# Altium schematic sheet Detector.SchDoc
size A4; SheetNumber: 1; SheetTotal: 1
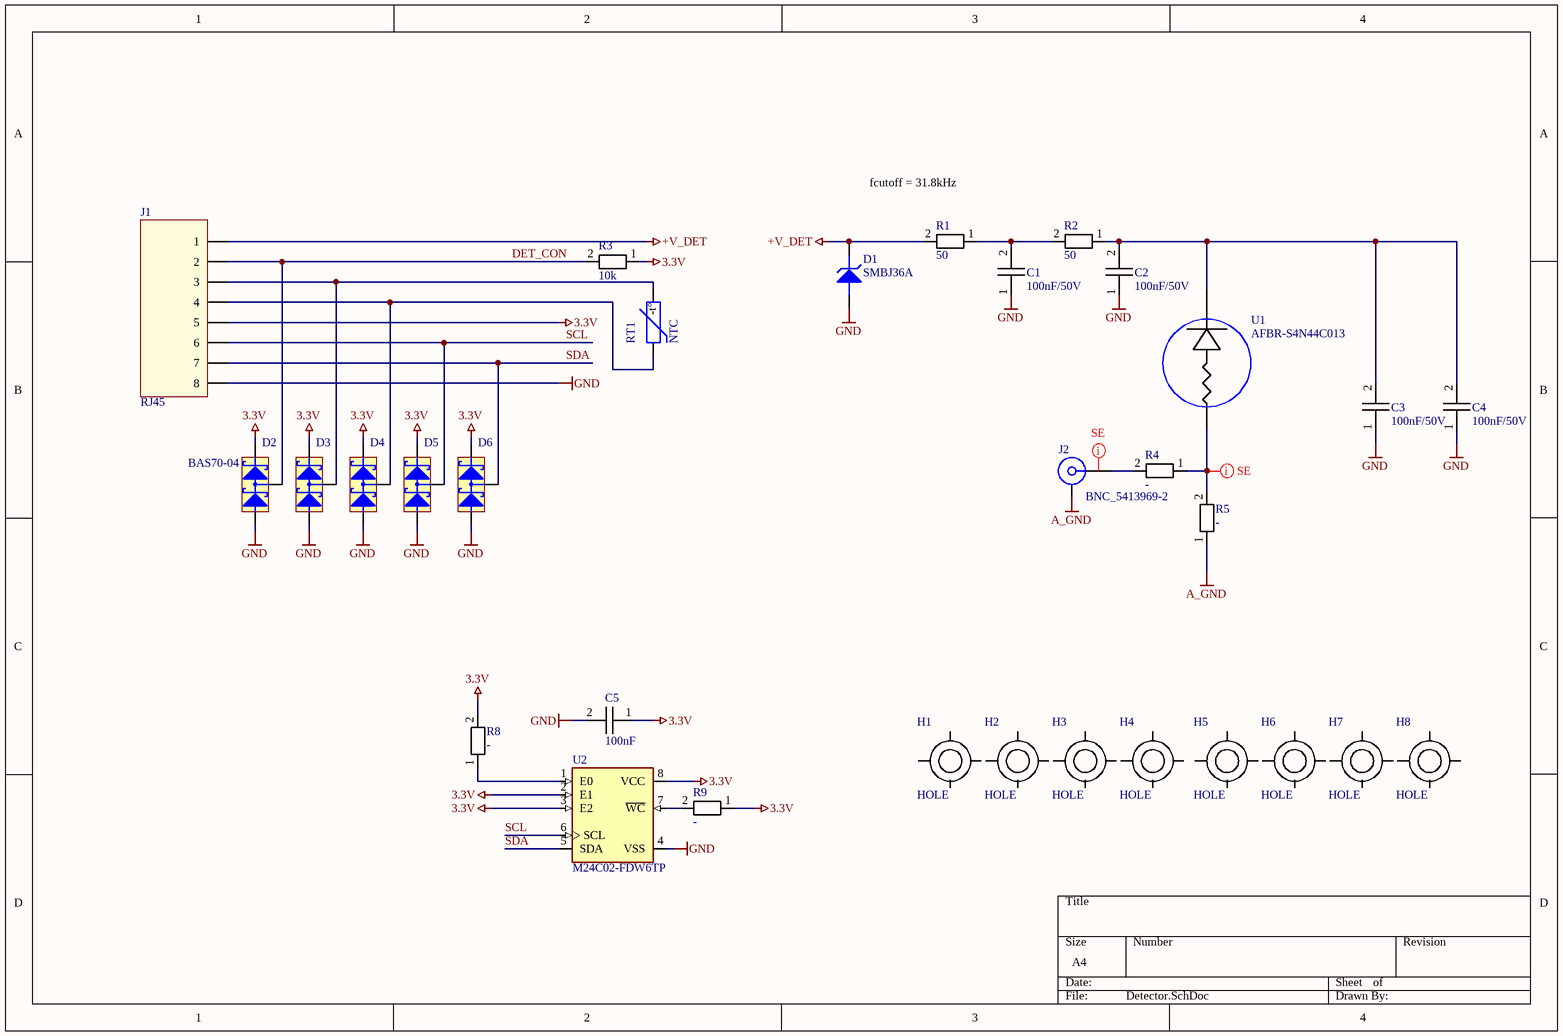
[diagram p0: Detector.SchDoc]

## Parts
C1  100nF/50V  [0805_C]
C2  100nF/50V  [0805_C]
C3  100nF/50V  [0805_C]
C4  100nF/50V  [0805_C]
C5  100nF  [0805_C]
D1  SMBJ36A  [DO-214AA (SMB)]
D2  BAS70-04  [SOT23]
D3  BAS70-04  [SOT23]  (value not drawn)
D4  BAS70-04  [SOT23]  (value not drawn)
D5  BAS70-04  [SOT23]  (value not drawn)
D6  BAS70-04  [SOT23]  (value not drawn)
H1  HOLE  [HOLE_140_160MIL]
H2  HOLE  [HOLE_140_160MIL]
H3  HOLE  [HOLE_140_160MIL]
H4  HOLE  [HOLE_140_160MIL]
H5  HOLE  [HOLE_140_160MIL]
H6  HOLE  [HOLE_140_160MIL]
H7  HOLE  [HOLE_140_160MIL]
H8  HOLE  [HOLE_140_160MIL]
J1  RJ45  [RJ45_180DEG_KEYSTONE949]
J2  BNC_5413969-2  [54139692]
R1  50  [0805]
R2  50  [0805]
R3  10k  [0805]
R4  -  [0805]
R5  -  [0805]
R8  -  [0805]
R9  -  [0805]
RT1  NTC  [0805]
U1  AFBR-S4N44C013  [BGA16C97P4X4_388X388X60]
U2  M24C02-FDW6TP  [TSSOP8]

## Nets
3.3V: C5.1 D2.2 D3.2 D4.2 D5.2 D6.2 J1.5 R3.1 R8.2 R9.1 U2.2(E1) U2.3(E2) U2.8(VCC)
+V_DET: D1.K J1.1 R1.2
A_GND: J2.MH1,MH2,MH3,MH4 R5.1
GND: C1.1 C2.1 C3.1 C4.1 C5.2 D1.A D2.1 D3.1 D4.1 D5.1 D6.1 J1.8 U2.4(VSS)
DET_CON: D2.3 J1.2 R3.2
SCL: D5.3 J1.6 U2.6(SCL)
SDA: D6.3 J1.7 U2.5(SDA)
NetC1_2: C1.2 R1.1 R2.2
NetC2_2: C2.2 C3.2 C4.2 R2.1 U1.B3,C2
NetD3_3: D3.3 J1.3 RT1.2
NetD4_3: D4.3 J1.4 RT1.1
NetJ2_1: J2.1 R4.2
NetR4_1: R4.1 R5.2 U1.B2,C3
NetR8_1: R8.1 U2.1(E0)
NetR9_2: R9.2 U2.7(~{WC})

## Layout directives
net class SINGLE50: (no net found under the mark), NetR4_1

## Notes on the sheet
- fcutoff = 31.8kHz
- (in symbol NTC) -t°

## Library data of the parts
C1-C5 = CAPACITOR
D1 = DIODE_TVS
J1 = RJ45: 90 deg RJ45 connector, without transformer / 180 deg RJ45 connector without transformer
R1 R2 R4 R5 R8 R9 = RESISTOR: Parameter 1: 10k
R3 = RESISTOR: Parameter 1: 10k
U2 = M24C02-FDW6TP: EEPROM Memory IC 2Kb (256 x 8) I2C 400kHz 900ns 8-TSSOP; MF: STMicroelectronics; Package: TSSOP-8 STMicroelectronics; MP: M24C02-FDW6TP; Digi-Key_Part_Number: 497-15746-1-ND; Value: *; SnapEDA_Link: https://www.snapeda.com/parts/M24C02-FDW6TP/STMicroelectronics/view-part/1102461/?ref=snap